# EAGLE design PrimaryLogger (EAGLE 9.5.2)

## Sheet 1 of 2
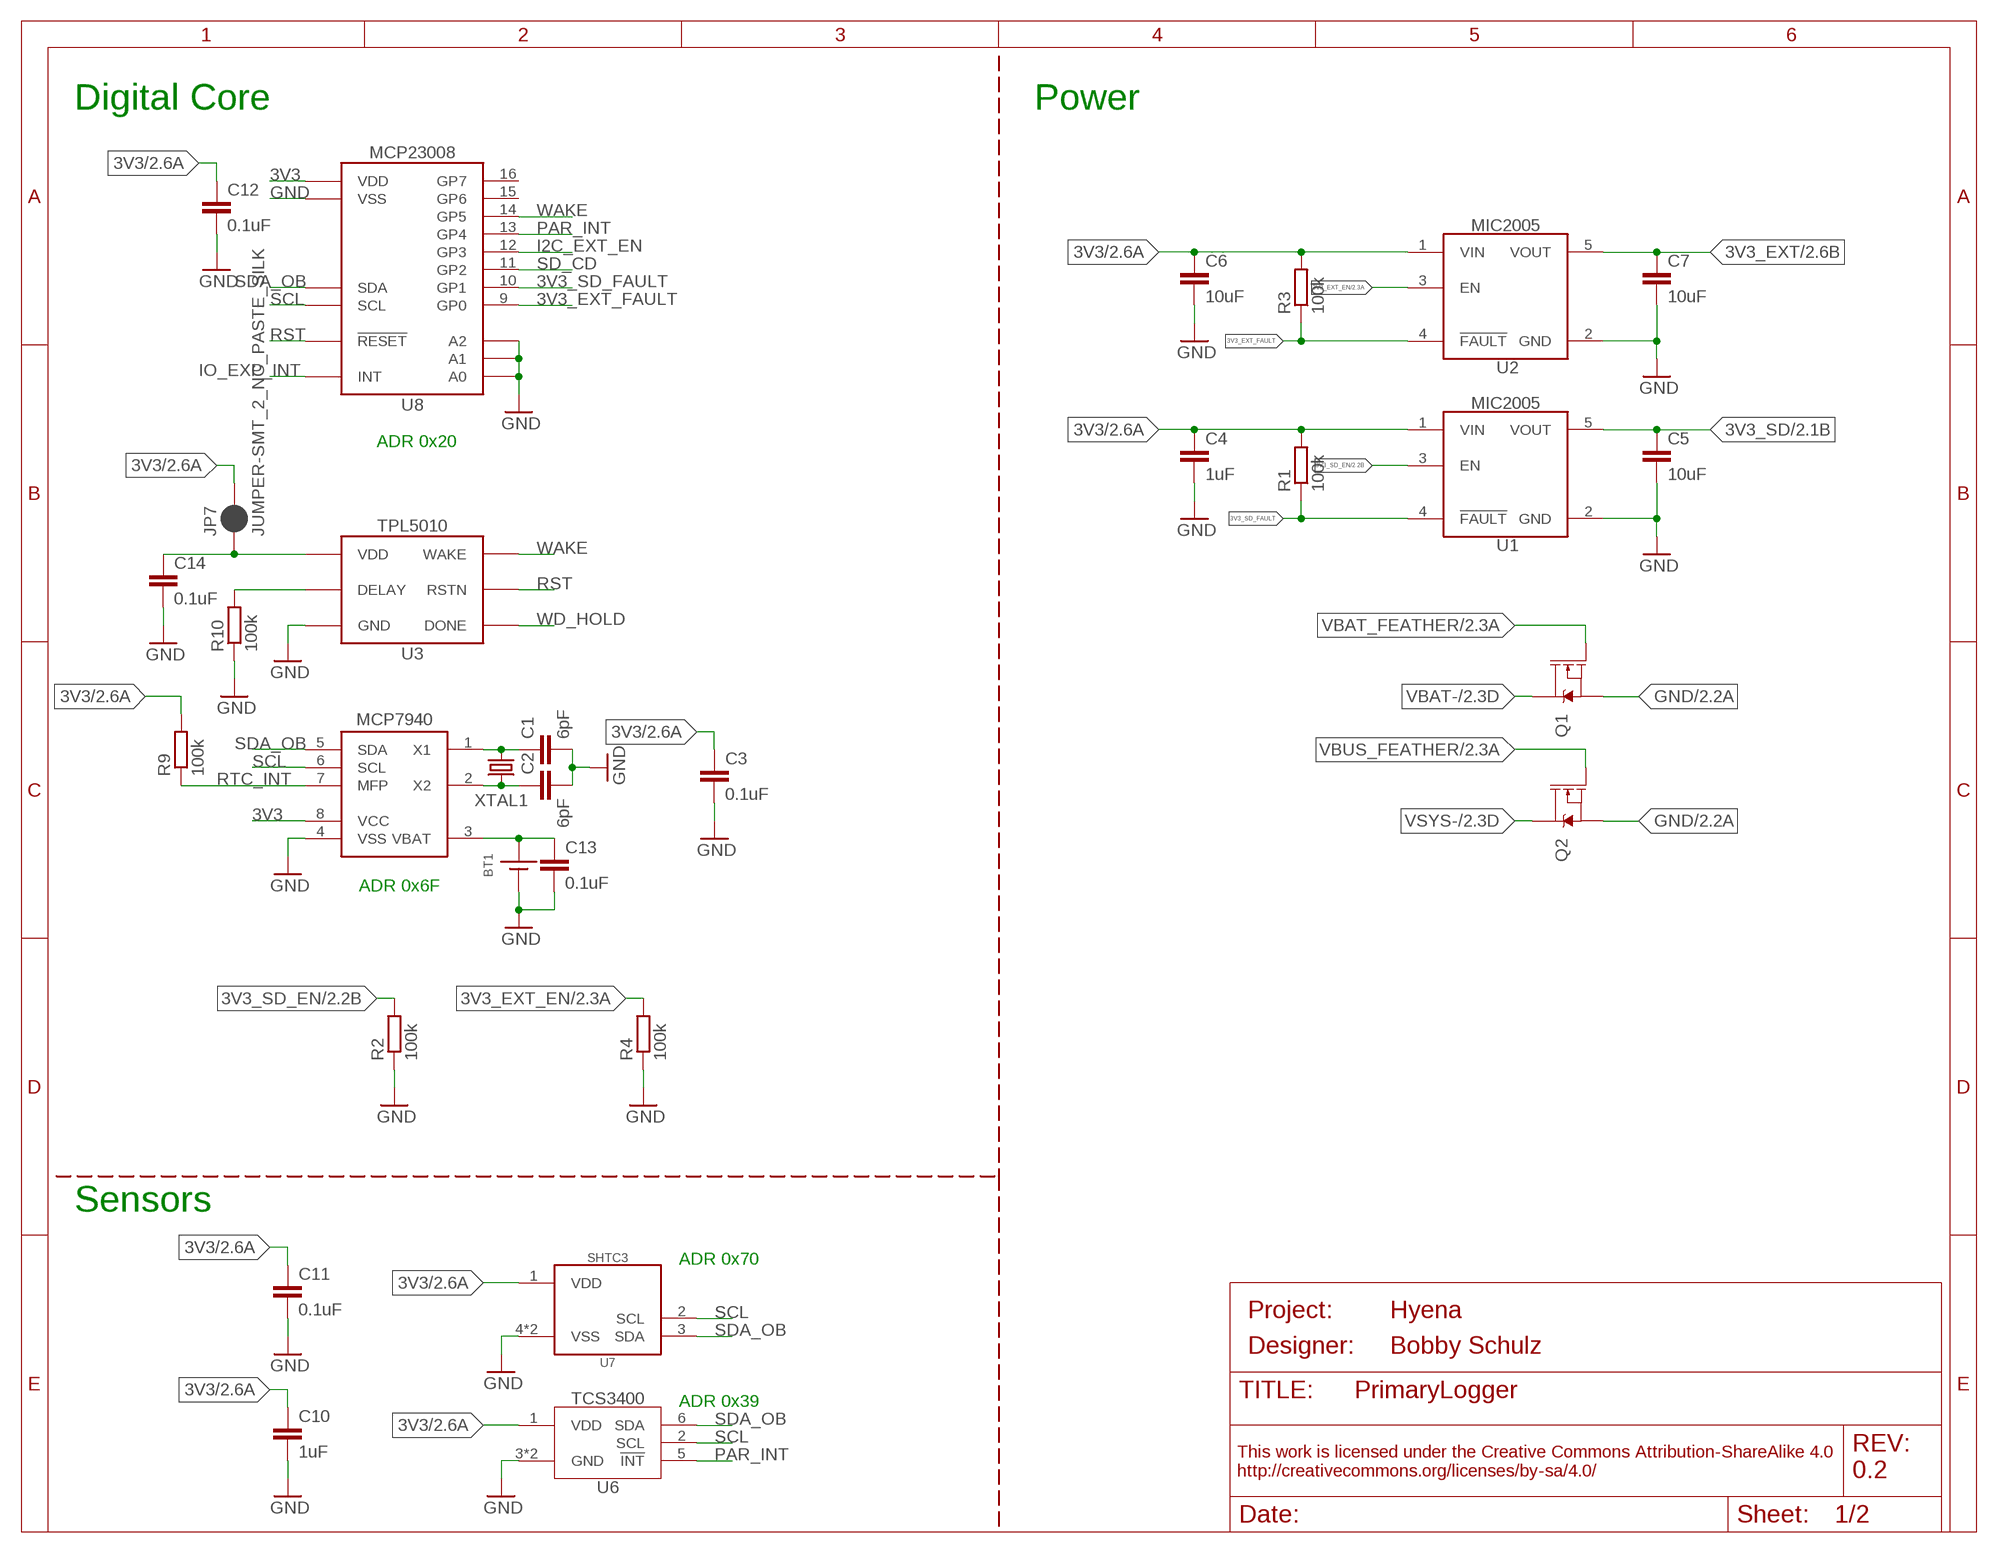
[diagram p0: schematic, sheet 1]
FRAME1 (FRAME_A_L): DESIGNER: Bobby Schulz; PROJECT: Hyena; REV: 0.2

### Parts
BT1  BATTERY_COIN12MM  [LINX_BAT-HLD-012-SMT]
C1  6pF  C-EU6PFC0402  [C0402]
C2  6pF  C-EU6PFC0402  [C0402]
C3  0.1uF  C-EU0.1UFC0603  [C0603]
C4  1uF  C-EU1UFC0603  [C0603]
C5  10uF  C-EU10UFC0805  [C0805]
C6  10uF  C-EU10UFC0805  [C0805]
C7  10uF  C-EU10UFC0805  [C0805]
C10  1uF  C-EU1UFC0603  [C0603]
C11  0.1uF  C-EU0.1UFC0603  [C0603]
C12  0.1uF  C-EU0.1UFC0603  [C0603]
C13  0.1uF  C-EU0.1UFC0603  [C0603]
C14  0.1uF  C-EU0.1UFC0603  [C0603]
JP7  JUMPER-SMT_2_NC_PASTE_SILK  [SMT-JUMPER_2_NC_PASTE_SILK]
Q1  DMG3404  MOSFET-NCH-DMG3404L  [SOT23-3]
Q2  DMG3404  MOSFET-NCH-DMG3404L  [SOT23-3]
R1  100k  R-EU_100KR0603  [R0603]
R2  100k  R-EU_100KR0603  [R0603]
R3  100k  R-EU_100KR0603  [R0603]
R4  100k  R-EU_100KR0603  [R0603]
R9  100k  R-EU_100KR0603  [R0603]
R10  100k  R-EU_100KR0603  [R0603]
U1  MIC2005  [SOT23-5]
U2  MIC2005  [SOT23-5]
U3  TPL5010DDC  [DDC_R-PDSO-G6]
U6  TCS3400  [TCS3400]
U7  SHTC3DFN  [DFN_4_2X2]
U8  MCP23008QFN  [QFN20]
U9  MCP7940SOIC  [SO08]
XTAL1  CRYSTAL3.2X1.5  [CRYSTAL_3.2X1.5_2-SMD]

### Nets
3V3: C3.1 C4.1 C6.1 C10.1 C11.1 C12.1 JP7.2 R1.2 R3.2 R9.2 U1.1(VIN) U2.1(VIN) U6.1(VDD) U7.1(VDD) U8.18(VDD) U9.8(VCC) ; also sheet 2
3V3_EXT: C7.1 U2.5(VOUT) ; also sheet 2
3V3_EXT_EN: R4.2 U2.3(EN) ; also sheet 2
3V3_EXT_FAULT: R3.1 U2.4(!FAULT) U8.9(GP0)
3V3_SD: C5.1 U1.5(VOUT) ; also sheet 2
3V3_SD_EN: R2.2 U1.3(EN) ; also sheet 2
3V3_SD_FAULT: R1.1 U1.4(!FAULT) U8.10(GP1)
GND: BT1.GND(-) C1.2 C2.2 C3.2 C4.2 C5.2 C6.2 C7.2 C10.2 C11.2 C12.2 C13.2 C14.2 Q1.2(S) Q2.2(S) R2.1 R4.1 R10.1 U1.2(GND) U2.2(GND) U3.2(GND) U6.3(GND) U6.4(GND) U7.4(VSS) U7.EP(VSS) U8.1(A2) U8.2(A1) U8.3(A0) U8.17(VSS) U8.EP(VSS) U9.4(VSS) ; also sheet 2
I2C_EXT_EN: U8.12(GP3) ; also sheet 2
IO_EXP_INT: U8.7(INT) ; also sheet 2
N$1: C1.1 U9.1(X1) XTAL1.P$1
N$2: C2.1 U9.2(X2) XTAL1.P$2
N$3: R10.2 U3.3(DELAY)
N$6: C14.1 JP7.1 U3.1(VDD)
PAR_INT: U6.5(!INT) U8.13(GP4) ; also sheet 2
RST: U3.6(RSTN) U8.4(!RESET) ; also sheet 2
RTC_INT: R9.1 U9.7(MFP) ; also sheet 2
SCL: U6.2(SCL) U7.2(SCL) U8.19(SCL) U9.6(SCL) ; also sheet 2
SD_CD: U8.11(GP2) ; also sheet 2
SDA_OB: U6.6(SDA) U7.3(SDA) U8.20(SDA) U9.5(SDA) ; also sheet 2
VBAT: BT1.POWER0(+) BT1.POWER1(+) C13.1 U9.3(VBAT)
VBAT-: Q1.3(D) ; also sheet 2
VBAT_FEATHER: Q1.1(G) ; also sheet 2
VBUS_FEATHER: Q2.1(G) ; also sheet 2
VSYS-: Q2.3(D) ; also sheet 2
WAKE: U3.5(WAKE) U8.14(GP5)
WD_HOLD: U3.4(DONE) ; also sheet 2
Unconnected: U8.15(GP6) U8.16(GP7)

### Notes on the sheet
- Digital Core | Power
- ADR 0x20
- ADR 0x6F
- Sensors
- ADR 0x70
- ADR 0x39

## Sheet 2 of 2
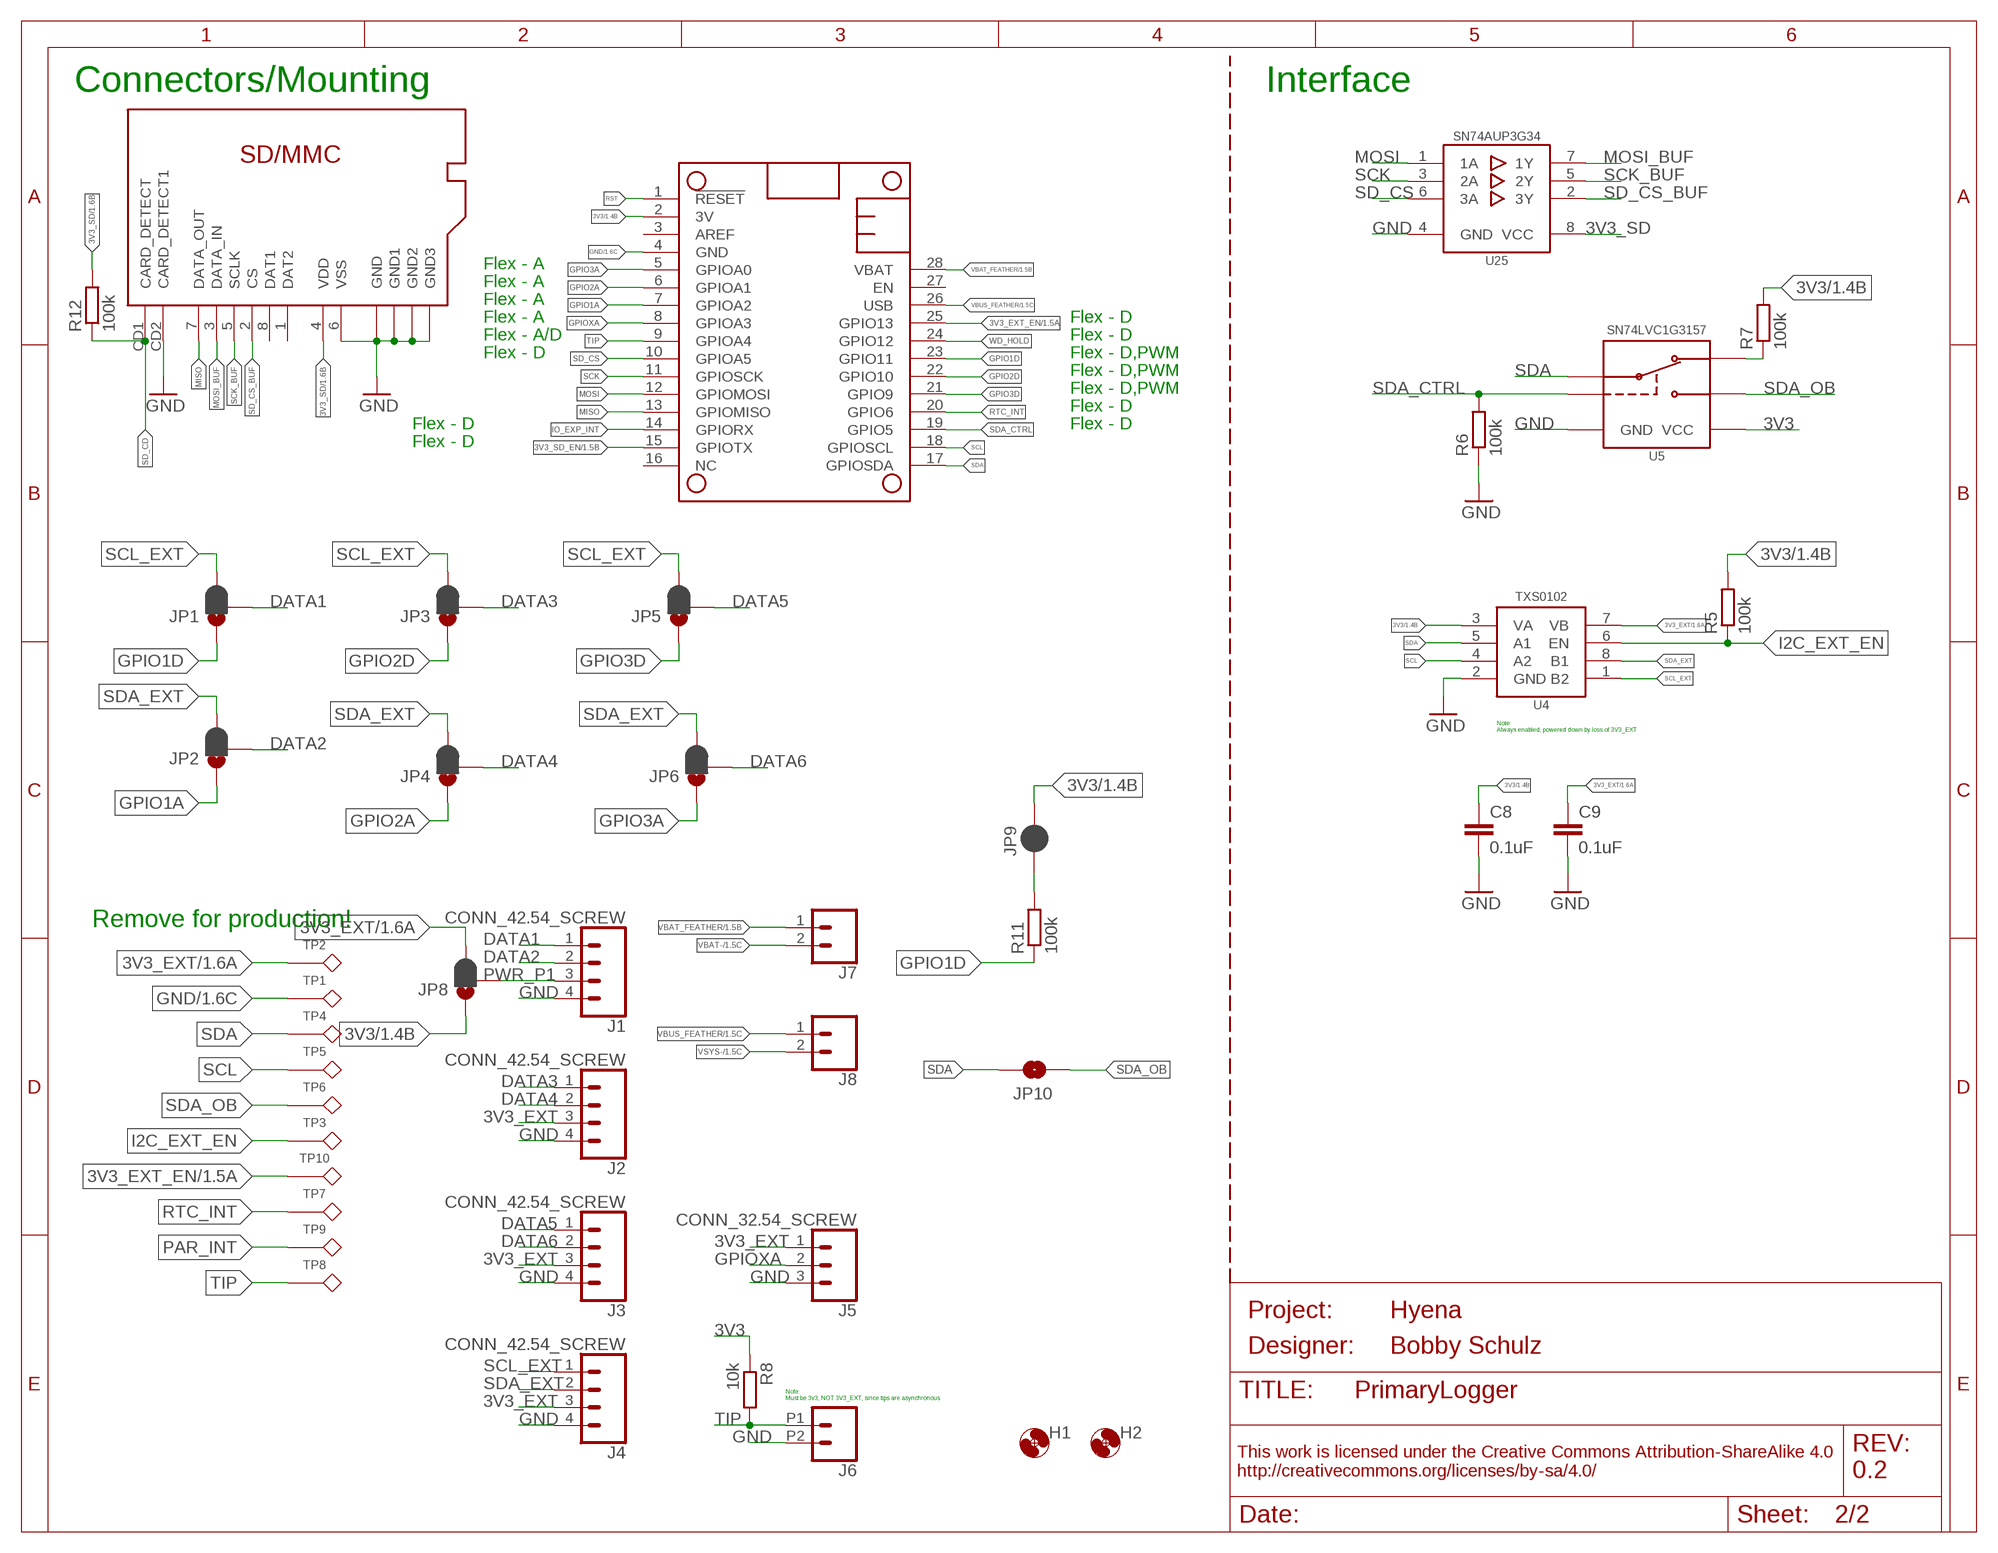
[diagram p1: schematic, sheet 2]
FRAME2 (FRAME_A_L): DESIGNER: Bobby Schulz; PROJECT: Hyena; REV: 0.2

### Parts
C8  0.1uF  C-EU0.1UFC0603  [C0603]
C9  0.1uF  C-EU0.1UFC0603  [C0603]
H1  MOUNTING_HOLE4_NP  [4_40]
H2  MOUNTING_HOLE4_NP  [4_40]
J1  CONN_42.54_SCREW  [1X04_SCREW]
J2  CONN_42.54_SCREW  [1X04_SCREW]
J3  CONN_42.54_SCREW  [1X04_SCREW]
J4  CONN_42.54_SCREW  [1X04_SCREW]
J5  CONN_32.54_SCREW  [1X03_SCREW]
J6  CONN_022.54_SCREW_ROUND  [1X02_2.54_SCREWTERM_ROUND]
J7  CONN_023.5MM_ROUND  [SCREWTERMINAL-3.5MM-2_ROUND]
J8  CONN_023.5MM_ROUND  [SCREWTERMINAL-3.5MM-2_ROUND]
JP1  JUMPER-SMT_3_1-NC_PASTE_SILK  [SMT-JUMPER_3_1-NC_PASTE_SILK]
JP2  JUMPER-SMT_3_1-NC_PASTE_SILK  [SMT-JUMPER_3_1-NC_PASTE_SILK]
JP3  JUMPER-SMT_3_1-NC_PASTE_SILK  [SMT-JUMPER_3_1-NC_PASTE_SILK]
JP4  JUMPER-SMT_3_1-NC_PASTE_SILK  [SMT-JUMPER_3_1-NC_PASTE_SILK]
JP5  JUMPER-SMT_3_1-NC_PASTE_SILK  [SMT-JUMPER_3_1-NC_PASTE_SILK]
JP6  JUMPER-SMT_3_1-NC_PASTE_SILK  [SMT-JUMPER_3_1-NC_PASTE_SILK]
JP8  JUMPER-SMT_3_1-NC_PASTE_SILK  [SMT-JUMPER_3_1-NC_PASTE_SILK]
JP9  JUMPER-SMT_2_NC_PASTE_SILK  [SMT-JUMPER_2_NC_PASTE_SILK]
JP10  JUMPER-SMT_2_NO_SILK  [SMT-JUMPER_2_NO_SILK]
MS1  FEATHERWING_NODIM  [FEATHERWING_DIM]
R5  100k  R-EU_100KR0603  [R0603]
R6  100k  R-EU_100KR0603  [R0603]
R7  100k  R-EU_100KR0603  [R0603]
R8  10k  R-EU_10KR0603  [R0603]
R11  100k  R-EU_100KR0603  [R0603]
R12  100k  R-EU_100KR0603  [R0603]
SD1  MICRO_SD  [CUSTOM-PARTS_SD_MICRO]
TP1  TESTPOINTRCU  [TESTPOINT_0603]
TP2  TESTPOINTRCU  [TESTPOINT_0603]
TP3  TESTPOINTRCU  [TESTPOINT_0603]
TP4  TESTPOINTRCU  [TESTPOINT_0603]
TP5  TESTPOINTRCU  [TESTPOINT_0603]
TP6  TESTPOINTRCU  [TESTPOINT_0603]
TP7  TESTPOINTRCU  [TESTPOINT_0603]
TP8  TESTPOINTRCU  [TESTPOINT_0603]
TP9  TESTPOINTRCU  [TESTPOINT_0603]
TP10  TESTPOINTRCU  [TESTPOINT_0603]
U4  TXS0102DCU  [DCU_(R-PDSO-G8)]
U5  SN74LVC1G3157SC70  [DCK_R-PDSO-G6]
U25  SN74AUP3G34DCU  [DCU_(R-PDSO-G8)]

### Nets
3V3: C8.1 JP8.1 JP9.2 MS1.2(3V) R5.2 R7.2 R8.1 U4.3(VA) U5.5(VCC) ; also sheet 1
3V3_EXT: C9.1 J2.3 J3.3 J4.3 J5.1 JP8.3 TP2.1 U4.7(VB) ; also sheet 1
3V3_EXT_EN: MS1.25(GPIO13) TP10.1 ; also sheet 1
3V3_SD: R12.2 SD1.4(VDD) U25.8(VCC) ; also sheet 1
3V3_SD_EN: MS1.15(GPIOTX) ; also sheet 1
DATA1: J1.1 JP1.2
DATA2: J1.2 JP2.2
DATA3: J2.1 JP3.2
DATA4: J2.2 JP4.2
DATA5: J3.1 JP5.2
DATA6: J3.2 JP6.2
GND: C8.2 C9.2 J1.4 J2.4 J3.4 J4.4 J5.3 J6.P2 MS1.4(GND) R6.1 SD1.6(VSS) SD1.CD2(CARD_DETECT1) SD1.GND@1(GND) SD1.GND@2(GND1) SD1.GND@3(GND2) SD1.GND@5(GND3) TP1.1 U4.2(GND) U5.2(GND) U25.4(GND) ; also sheet 1
GPIO1A: JP2.1 MS1.7(GPIOA2)
GPIO1D: JP1.1 MS1.23(GPIO11) R11.1
GPIO2A: JP4.1 MS1.6(GPIOA1)
GPIO2D: JP3.1 MS1.22(GPIO10)
GPIO3A: JP6.1 MS1.5(GPIOA0)
GPIO3D: JP5.1 MS1.21(GPIO9)
GPIOXA: J5.2 MS1.8(GPIOA3)
I2C_EXT_EN: R5.1 TP3.1 U4.6(EN) ; also sheet 1
IO_EXP_INT: MS1.14(GPIORX) ; also sheet 1
MISO: MS1.13(GPIOMISO) SD1.7(DATA_OUT)
MOSI: MS1.12(GPIOMOSI) U25.1(1A)
MOSI_BUF: SD1.3(DATA_IN) U25.7(1Y)
N$4: R7.1 U5.3(B1)
N$5: JP9.1 R11.2
PAR_INT: TP9.1 ; also sheet 1
PWR_P1: J1.3 JP8.2
RST: MS1.1(!RESET) ; also sheet 1
RTC_INT: MS1.20(GPIO6) TP7.1 ; also sheet 1
SCK: MS1.11(GPIOSCK) U25.3(2A)
SCK_BUF: SD1.5(SCLK) U25.5(2Y)
SCL: MS1.18(GPIOSCL) TP5.1 U4.4(A2) ; also sheet 1
SCL_EXT: J4.1 JP1.3 JP3.3 JP5.3 U4.1(B2)
SD_CD: R12.1 SD1.CD1(CARD_DETECT) ; also sheet 1
SD_CS: MS1.10(GPIOA5) U25.6(3A)
SD_CS_BUF: SD1.2(CS) U25.2(3Y)
SDA: JP10.2 MS1.17(GPIOSDA) TP4.1 U4.5(A1) U5.4(A)
SDA_CTRL: MS1.19(GPIO5) R6.2 U5.6(S)
SDA_EXT: J4.2 JP2.3 JP4.3 JP6.3 U4.8(B1)
SDA_OB: JP10.1 TP6.1 U5.1(B2) ; also sheet 1
TIP: J6.P1 MS1.9(GPIOA4) R8.2 TP8.1
VBAT-: J7.2 ; also sheet 1
VBAT_FEATHER: J7.1 MS1.28(VBAT) ; also sheet 1
VBUS_FEATHER: J8.1 MS1.26(USB) ; also sheet 1
VSYS-: J8.2 ; also sheet 1
WD_HOLD: MS1.24(GPIO12) ; also sheet 1
Unconnected: MS1.3(AREF) MS1.16(NC) MS1.27(EN) SD1.1(DAT2) SD1.8(DAT1)

### Notes on the sheet
- Connectors/Mounting | Interface
- Flex - A
- Flex - A
- Flex - A
- Flex - A | Flex - D
- Flex - A/D | Flex - D
- Flex - D | Flex - D,PWM
- Flex - D,PWM
- Flex - D,PWM
- Flex - D
- Flex - D | Flex - D
- Flex - D
- Note:
  Always enabled, powered down by loss of 3V3_EXT
- Remove for production!
- Note:
  Must be 3v3, NOT 3V3_EXT, since tips are asynchronous

## Library data of the parts
BT1 = bschulz:BATTERY_COIN: Coin Cell Battery Holder; DIGIKEY: BAT-HLD-012-SMT-ND; MF: Linx; MPN: BAT-HLD-012-SMT
C1 C2 = bschulz_passives:C-EU: CAPACITOR, European symbol; DIGIKEY: 490-3104-1-ND; MF: Murata; MPN: GJM1555C1H6R0CB01D
C3 C8 C9 C11-C14 = bschulz_passives:C-EU: CAPACITOR, European symbol; DIGIKEY: 490-6051-1-ND; MF: Murata; MPN: GCM188R71E104KA57D
C4 C10 = bschulz_passives:C-EU: CAPACITOR, European symbol; DIGIKEY: 587-1251-1-ND; MF: Yaiyo Yuden; MPN: EMK107BJ105KA-T
C5-C7 = bschulz_passives:C-EU: CAPACITOR, European symbol; DIGIKEY: 490-6473-6-ND; MF: Murata; MPN: GRM21BR61C106KE15K
H1 H2 = bschulz:MOUNTING_HOLE: Genaric Mechanical Mounting Hole Hole diameter based on max body diameter + 15% Keepout ring is for diameter of socket cap screw (minimum required clearance) TPlace ring is for diameter of pan head screw (recomended clearance) Specifications: Socket Cap <http://fastener-express.com/fastener-technical/SocketscapSS-Alloy.pdf> Button Head Socket Cap <http://fastener-express.com/fastener-technical/Button-Socket-alloy.pdf> Pan Head <http://fastener-express.com/fastener-technical/pan-machine-Screws.pdf>; DIGIKEY: DNP; MF: N/A; MPN: DNP
J1-J4 = bschulz:CONN_4: Genaric 4 terminal header Digikey 2.54_SCREW <https://www.digikey.com/product-detail/en/on-shore-technology-inc/OSTVN04A150/ED10563-ND/1588864>; DIGIKEY: ED10563-ND; MF: On Shore; MPN: OSTVN04A150
J5 = bschulz:CONN_3: Genaric 3 terminal header Digikey 2.54_SCREW <https://www.digikey.com/product-detail/en/on-shore-technology-inc/OSTVN03A150/ED10562-ND/1588863> 3.5_SCREW <https://www.digikey.com/product-detail/en/on-shore-technology-inc/OSTTE030161/ED2636-ND/614585>; DIGIKEY: ED10562-ND; MF: On Shore; MPN: OSTVN03A150
J6 = bschulz:CONN_02: Genaric 2 terminal header SCREW_2.54 <https://www.digikey.com/product-detail/en/on-shore-technology-inc/OSTVN02A150/ED10561-ND/1588862> 39532_RA <https://www.digikey.com/product-detail/en/molex/0395321002/WM7845-ND/1280696>; DIGIKEY: ED10561-ND; MF: OnShore; MPN: OSTVN02A150
J7 J8 = bschulz:CONN_02: Genaric 2 terminal header SCREW_2.54 <https://www.digikey.com/product-detail/en/on-shore-technology-inc/OSTVN02A150/ED10561-ND/1588862> 39532_RA <https://www.digikey.com/product-detail/en/molex/0395321002/WM7845-ND/1280696>; DIGIKEY: ED2635-ND; MF: OnShore; MPN: OSTTE020161
JP1-JP6 JP8 = bschulz:JUMPER-SMT_3_1-NC_PASTE: Normally closed solder jumper (1 of 2 connections) This jumper has an aperture in the stencil to allow solder paste to bridge one of the two connections. One connection is normally closed (NC), while the other is normally open (NO). Wick off the solder to open the connection. Reapply solder to reclose the connection. Apply solder to the other side instead to change the current path.; DIGIKEY: DNP; MF: N/A; MPN: N/A
JP7 JP9 = bschulz:JUMPER-SMT_2_NC_PASTE: Normally closed solder jumper This jumper has an aperture in the stencil to allow solder paste to bridge the split in the wire so it's normally closed (NC). Wick off the solder to open the connection. Reapply solder to reclose the connection.; DIGIKEY: DNP; MF: N/A; MPN: N/A
JP10 = bschulz:JUMPER-SMT_2_NO: Normally open jumper This jumper has two pads in close proximity to each other. Apply solder to close the connection. Round pads are easier to solder for beginners, but are a lot larger. SparkFun Product that uses the round pads: SparkFun EL Sequencer <https://www.sparkfun.com/products/12781>; DIGIKEY: DNP; MF: N/A; MPN: N/A
MS1 = bschulz:FEATHERWING
Q1 Q2 = bschulz:MOSFET-NCH: N-channel MOSFETs Voltage controlled devices that allow control of high current outputs. SparkFun Products: SparkFun OpenScale <https://www.sparkfun.com/products/13261> SparkFun Digital Sandbox <https://www.sparkfun.com/products/12651> SparkFun Monster Moto Shield <https://www.sparkfun.com/products/10182> SparkFun MOSFET Power Controller <https://www.sparkfun.com/products/11214>; DIGIKEY: DMG3404L-7DICT-ND; MF: Diodes Incorporated; MPN: DMG3404L-7
R1-R7 R9-R12 = bschulz_passives:R-EU_: RESISTOR, European symbol Digikey Parts: Yageo, 0402 <https://www.digikey.com/products/en/resistors/chip-resistor-surface-mount/52?k=&pkeyword=&sv=0&s=4356&sf=1&FV=-1%7C13%2C7%7C2%2C1291%7C39157%2C1989%7C0%2C-8%7C52%2C3%7C1131%2C3%7C2503&quantity=&ColumnSort=0&page=1&stock=1&pageSize=25> Yageo, 0603 <https://www.digikey.com/products/en/resistors/chip-resistor-surface-mount/52?k=&pkeyword=&sv=0&pv1291=39245&sf=1&FV=-5%7C4356%2C-5%7C47360%2C-8%7C52%2C-1%7C13%2C7%7C2%2C1989%7C0&quantity=10&ColumnSort=1000011&page=1&stock=1&pageSize=25> Panasonic, 0603 <https://www.digikey.com/products/en/resistors/chip-resistor-surface-mount/52?k=&pkeyword=&pv252=68&sf=0&FV=ffec373d%2C1c0002%2C142c040c%2C1f140000%2Cffe00034%2C80002%2Cc0001&quantity=&ColumnSort=0&page=1&stock=1&pageSize=25> Panasonic, precision, 0603 <https://www.digikey.com/products/en/resistors/chip-resistor-surface-mount/52?FV=ffec4907%2Cfffc000a%2Cc0172%2C142c040c%2C1f140000%2Cffe00034%2C1c0002&quantity=100&ColumnSort=2085&page=1&stock=1&pageSize=25> Panasonic, 0805 <https://www.digikey.com/products/en/resistors/chip-resistor-surface-mount/52?k=&pkeyword=&pv3=1&sf=0&FV=ffec373d%2C1c0002%2C1f140000%2Cffe00034%2C142c040d&quantity=&ColumnSort=0&page=1&stock=1&pageSize=25> Rohm, current sense <https://www.digikey.com/products/en/resistors/chip-resistor-surface-mount/52?k=&pkeyword=&pv3=1&sf=0&FV=ffecb688%2C1f140000%2Cffe00034%2C1c0002&quantity=&ColumnSort=0&page=1&stock=1&pageSize=25> Vishay, pulse proof automotive <https://www.digikey.com/products/en/resistors/chip-resistor-surface-mount/52?k=&pkeyword=&pv7=2&sf=0&FV=ffec5d6b%2Cffe00034%2C1f140000&quantity=&ColumnSort=0&page=1&stock=1&pageSize=25>; DIGIKEY: 311-100KHRCT-ND; MF: Yageo; MPN: RC0603FR-07100KL; VALUE_PART: 100k
R8 = bschulz_passives:R-EU_: RESISTOR, European symbol Digikey Parts: Yageo, 0402 <https://www.digikey.com/products/en/resistors/chip-resistor-surface-mount/52?k=&pkeyword=&sv=0&s=4356&sf=1&FV=-1%7C13%2C7%7C2%2C1291%7C39157%2C1989%7C0%2C-8%7C52%2C3%7C1131%2C3%7C2503&quantity=&ColumnSort=0&page=1&stock=1&pageSize=25> Yageo, 0603 <https://www.digikey.com/products/en/resistors/chip-resistor-surface-mount/52?k=&pkeyword=&sv=0&pv1291=39245&sf=1&FV=-5%7C4356%2C-5%7C47360%2C-8%7C52%2C-1%7C13%2C7%7C2%2C1989%7C0&quantity=10&ColumnSort=1000011&page=1&stock=1&pageSize=25> Panasonic, 0603 <https://www.digikey.com/products/en/resistors/chip-resistor-surface-mount/52?k=&pkeyword=&pv252=68&sf=0&FV=ffec373d%2C1c0002%2C142c040c%2C1f140000%2Cffe00034%2C80002%2Cc0001&quantity=&ColumnSort=0&page=1&stock=1&pageSize=25> Panasonic, precision, 0603 <https://www.digikey.com/products/en/resistors/chip-resistor-surface-mount/52?FV=ffec4907%2Cfffc000a%2Cc0172%2C142c040c%2C1f140000%2Cffe00034%2C1c0002&quantity=100&ColumnSort=2085&page=1&stock=1&pageSize=25> Panasonic, 0805 <https://www.digikey.com/products/en/resistors/chip-resistor-surface-mount/52?k=&pkeyword=&pv3=1&sf=0&FV=ffec373d%2C1c0002%2C1f140000%2Cffe00034%2C142c040d&quantity=&ColumnSort=0&page=1&stock=1&pageSize=25> Rohm, current sense <https://www.digikey.com/products/en/resistors/chip-resistor-surface-mount/52?k=&pkeyword=&pv3=1&sf=0&FV=ffecb688%2C1f140000%2Cffe00034%2C1c0002&quantity=&ColumnSort=0&page=1&stock=1&pageSize=25> Vishay, pulse proof automotive <https://www.digikey.com/products/en/resistors/chip-resistor-surface-mount/52?k=&pkeyword=&pv7=2&sf=0&FV=ffec5d6b%2Cffe00034%2C1f140000&quantity=&ColumnSort=0&page=1&stock=1&pageSize=25>; DIGIKEY: 311-10.0KHRCT-ND; MF: Yageo; MPN: RC0603FR-0710KL; VALUE_PART: 10k
SD1 = bschulz:MICRO_SD: Micro SD Card - Card Detect, Exposed leads for non-reflow soldering Characteristics: Number of Positions: 10 (8 + 2) Insertion/Removal: Push In, Pull Out Switch: Yes Digikey: 114-00841-68-1-ND (Amphenol) <https://www.digikey.com/product-detail/en/amphenol-icc-commercial-products/114-00841-68/114-00841-68-1-ND/2187101> HR1941CT-ND (Hirose Alternative) <https://www.digikey.com/product-detail/en/hirose-electric-co-ltd/DM3D-SF/HR1941CT-ND/1786515>; DIGIKEY: 114-00841-68-1-ND; MF: Amphenol; MPN: 114-00841-68
TP1-TP10 = bschulz:TESTPOINT; DIGIKEY: A106145CT-ND; MF: TE Connectivity; MPN: RCU-0C
U1 U2 = bschulz:MIC2005: MIC2005 - Hight Side Load Switch, with Fixed Current Limit Characteristics: Vin: 2.5v ~ 5.5v IQ: 1μA (OFF), 80μA (ON) RDS(ON): 170mΩ (Vin = 5v) UVLO: 2.25V Output Current: 500/800/1200mA Operating Temperature: -40°C to 85°C Digikey: MIC2005A-1 <https://www.digikey.com/product-detail/en/microchip-technology/MIC2005A-1YM5-TR/576-3462-1-ND/2062462>; DIGIKEY: 576-3462-1-ND; DISP: MIC2005; MF: Microchip; MPN: MIC2005A-1YM5-TR
U3 = bschulz:TPL5010: TPL5010 - Nano-Power System Timer with Watchdog Functionality Characteristics: Vdd: 1.8V ~ 5.5V IQ: 35nA (typ) Period: 100ms ~ 7200 s Operating Temperature: -40°C to 85°C Digikey: 296-38829-1-ND <https://www.digikey.com/product-detail/en/texas-instruments/TPL5010DDCT/296-38829-1-ND/5130149>; DIGIKEY: 296-38829-1-ND; MF: TI; MPN: TPL5010DDCT
U4 = bschulz:TXS0102: TXS0102 - 2 Channel Bidirectional Voltage Level Translator Characteristics: Vcc: 1.65 ~ 3.6V (Port A), 2.3 ~ 5.5V (Port B) IQ: 14.4μA Output Current: 50mA Output Type: Open Drain/Push-Pull Operating Temperature: -40°C to 85°C Digikey: 296-28368-1-ND (DQE) <https://www.digikey.com/product-detail/en/texas-instruments/TXS0102DQER/296-28368-1-ND/2625893> 296-28435-1-ND (DQM) <https://www.digikey.com/product-detail/en/texas-instruments/TXS0102DQMR/296-28435-1-ND/2638910> 296-21931-1-ND (DCU) <https://www.digikey.com/product-detail/en/texas-instruments/TXS0102DCUR/296-21931-1-ND/1629284>; DIGIKEY: 296-21931-1-ND; MF: TI; MPN: TXS0102DCUR
U5 = bschulz:SN74LVC1G3157: SN74LVC1G3157 - SPDT Analog Switch Characteristics: VCC: 1.65~5.5V Operating Temperature: -40°C to 85°C On state resistace: 15 Ω, Max Channel to Channel Matching: 0.1 Ω, Typical Digikey: 296-14909-1-ND (SC70, DCK) <https://www.digikey.com/product-detail/en/texas-instruments/SN74LVC1G3157DCKR/296-14909-1-ND/562526> 296-18015-1-ND (SOT-666, DRL) <https://www.digikey.com/product-detail/en/texas-instruments/SN74LVC1G3157DRLR/296-18015-1-ND/770530>; DIGIKEY: 296-14909-1-ND; DISP: SN74LVC1G3157; MF: TI; MPN: SN74LVC1G3157DCKR
U6 = bschulz:TCS3400: TCS3400 - Ambient Multi-Band Light Sensor with I2C Interface Characteristics: VCC: 2.7~3.6V VIO: Vcc (TCS34001/5), 1.8V (TCS34003/7) Operating Temperature: -40°C to 70°C Digikey: TCS34003FNMCT-ND <https://www.digikey.com/products/en/sensors-transducers/optical-sensors-ambient-light-ir-uv-sensors/536?k=tcs3400&k=&pkeyword=tcs3400&sv=0&pv7=2&sf=0&FV=-8%7C536%2C1989%7C0&quantity=&ColumnSort=0&page=1&stock=1&pageSize=25>; DIGIKEY: TCS34003FNMCT-ND; MF: AMS; MPN: TCS34003FNM
U7 = bschulz:SHTC*: SHTCx - Digital Humidity and Temperature Sensor Characteristics (for SHTC3): Vcc: 1.62V ~ 3.6V Humidity Resolution: 0.01% RH Humidity Accuracy: ±2% RH Temperature Resolution: 0.01°C Temperature Accuracy: 0.2°C Operating Temperature: -40°C to 125°C Digikey: 1649-1100-1-ND (SHTC3) <https://www.digikey.com/product-detail/en/sensirion-ag/SHTC3/1649-1100-1-ND/8628149> 1649-1015-1-ND (SHTC1) <https://www.digikey.com/product-detail/en/sensirion-ag/SHTC1/1649-1015-1-ND/5872297>; DIGIKEY: 1649-1100-1-ND; DISP: SHTC3; MF: Sensirion; MPN: SHTC3
U8 = bschulz:MCP23008: MCP23008 - I2C I/O Expander, 8 bit wtih interrupt and reset Characteristics: Vcc: 1.8V ~ 5.5V IOut: 25 mA IQ: 1μA Operating Temperature: -40°C to 85°C Internal Configurable Pullups Digikey: MCP23008T-E/MLCT-ND (QFN) <https://www.digikey.com/product-detail/en/microchip-technology/MCP23008T-E-ML/MCP23008T-E-MLCT-ND/7916525> MCP23008T-E/SOCT-ND (SOIC) <https://www.digikey.com/product-detail/en/microchip-technology/MCP23008T-E-SO/MCP23008T-E-SOCT-ND/5358243> MCP23008T-E/SSCT-ND (SSOP) <https://www.digikey.com/product-detail/en/microchip-technology/MCP23008T-E-SS/MCP23008T-E-SSCT-ND/5013523>; DIGIKEY: MCP23008T-E/MLCT-ND; MF: Microchip; MPN: MCP23008T-E/ML
U9 = bschulz:MCP7940: MCP7940 - RTC Characteristics: VCC: 1.8~5.5V VBat: 1.3~5.5V Memory: 64B Interface: I2C Operating Temperature: -40°C to 85°C Digikey: MCP7940N-I/SN-ND <https://www.digikey.com/scripts/DkSearch/dksus.dll?Detail&itemSeq=257151033&uq=636590618847128166> Pin Compatible Alternatives <https://www.digikey.com/products/en/integrated-circuits-ics/clock-timing-real-time-clocks/690?FV=401994%2C26802e4%2C45003ef%2C450041e%2C4500072%2C450050c%2C4500565%2C450057c%2C450057e%2C4500010%2C4500011%2C4500017%2C450017d%2C4500180%2C450004f%2C1f140000%2Cffe002b2%2C16980015%2C1698001a%2C1698001d%2C16980026%2C16980027%2C16980029%2C16980036%2C16980009&quantity=10&ColumnSort=1000011&page=2&stock=1&nstock=1&pageSize=25> Note: These are recomendations at the time, always verify pin compatability using combination of Mrk1 EyeBall and quality datasheet; DIGIKEY: MCP7940N-I/SN-ND; MF: Microchip; MPN: MCP7940N-I/SN
U25 = bschulz:SN74AUP3G34: SN74AUP3G34 - Logic Buffer Characteristics: VCC: 0.8~3.6V Operating Temperature: -40°C to 85°C Number of Gates: 3 /li> Inverting: No Digikey: 296-27503-1-ND (UQFN, RSE) <https://www.digikey.com/scripts/DkSearch/dksus.dll?Detail&itemSeq=257211059&uq=636588853324239862> 296-36973-1-ND (XFDFN, DQE) <https://www.digikey.com/product-detail/en/texas-instruments/SN74AUP3G34DQER/296-36973-1-ND/4428921> 296-25595-1-ND (VFSOP, DCU) <https://www.digikey.com/product-detail/en/texas-instruments/SN74AUP3G34DCUR/296-25595-1-ND/2202056>; DIGIKEY: 296-25595-1-ND; MF: TI; MPN: SN74AUP3G34DCUR
XTAL1 = bschulz:CRYSTAL: Crystal Oscilator 2 Pin quartz crystal oscilators Variants 3.2x1.5mm (Only available in 32.768kHz) <https://www.digikey.com/products/en/crystals-oscillators-resonators/crystals/171?FV=b839bf%2Cb83a33%2C8640001%2C864000f%2C8640003%2C1f140000%2Cmu32.768kHz%7C2150%2Cffe000ab&quantity=10&ColumnSort=1000011&page=1&stock=1&k=crystal&pageSize=25&pkeyword=crystal> 5 x 3.2mm (8MHz ~ 50MHz) <https://www.digikey.com/products/en/crystals-oscillators-resonators/crystals/171?FV=402f3e%2Cb8434d%2C1f140000%2Cffe000ab&quantity=10&ColumnSort=1000011&page=1&stock=1&pageSize=25>; DIGIKEY: 535-11937-1-ND; MF: ABS07-120-32.768KHZ-T; MPN: Abracon

## Board
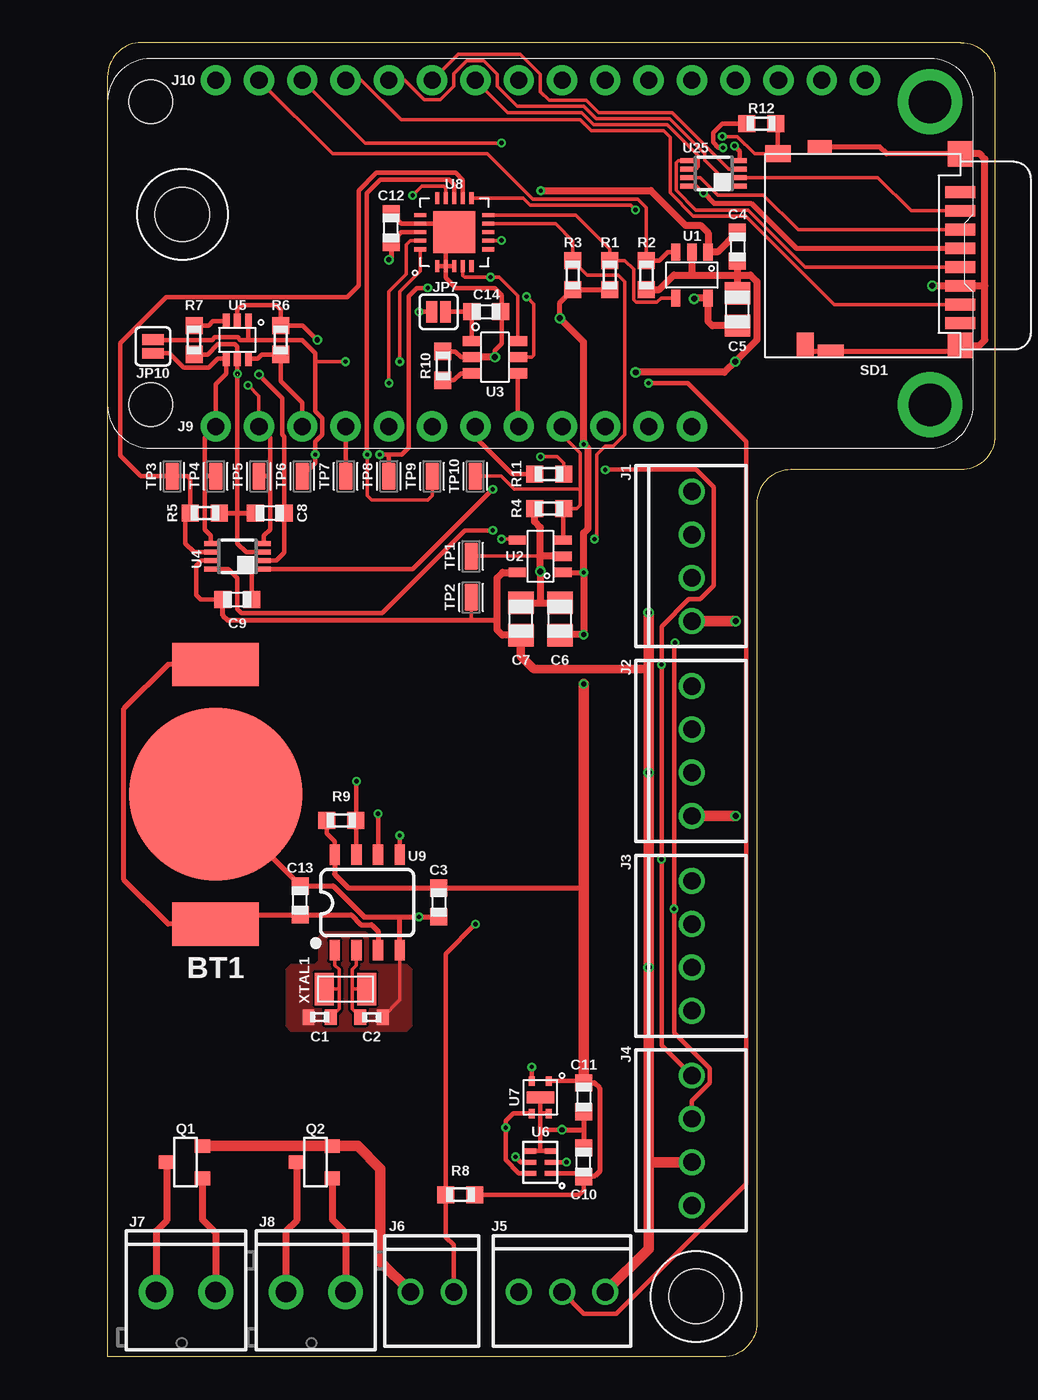
[diagram p2: board, top side]
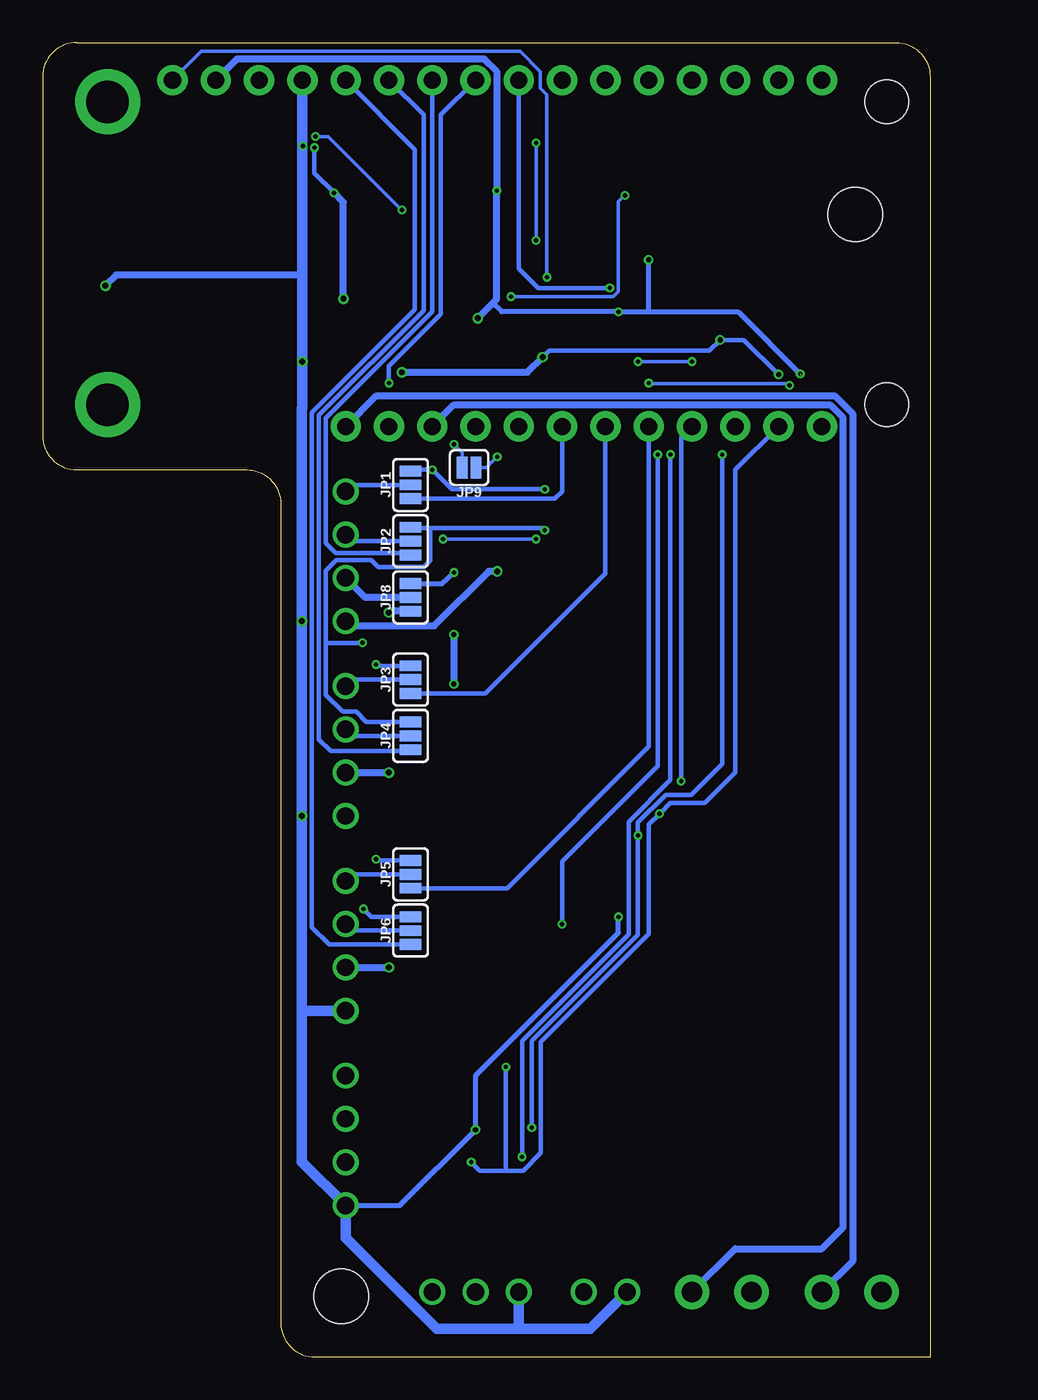
[diagram p3: board, bottom side, seen from below]

Size 52.07 x 77.14 mm. Coordinates in mm from the lower left corner, seen from the top.
Outline: 38.1,50.07 38.1,2 arc-90 36.1,0 0,0 0,75.14 arc-90 2,77.14 50.07,77.14 arc-90 52.07,75.14 52.07,54.07 arc-90 50.07,52.07 40.1,52.07 arc90 38.1,50.07
Copper layers (1*16): Top 0.035559375mm / dielectric 1.6mm / Bottom 0.035559375mm
Design rules "oshpark-2layer": minimum track width 6mil, minimum drill 10mil, track to track 6mil, track to pad 6mil, pad to pad 6mil, via to via 6mil, smd to smd 6mil, copper to edge 15mil, drill to drill 6mil, minimum pad ring 5mil, minimum via ring 5mil, stop-mask expansion 2.5mil, vias tented up to drill 0mil, thermal gap 10mil

### Footprints (pad centres in the part's own frame; a part is rotated, then mirrored left to right if it is on the bottom)
LINX_BAT-HLD-012-SMT = smd 10.16 x 10.16: GND 0,0 | smd 2.54 x 5.08: POWER0 -7.62,0; POWER1 7.62,0
C0402 = smd 0.7 x 0.9: 1 -0.65,0; 2 0.65,0
C0603 = smd 1 x 1: 1 -0.85,0; 2 0.85,0
C0805 = smd 1.3 x 1.5: 1 -0.95,0; 2 0.95,0
4_40 = hole 3.175: 0,0
1X04_SCREW = drill 1.016: 1 -3.81,0; 2 -1.27,0; 3 1.27,0; 4 3.81,0
1X03_SCREW = drill 1.016: 1 -2.54,0; 2 0,0; 3 2.54,0
1X02_2.54_SCREWTERM_ROUND = drill 1.016: P1 1.27,0; P2 -1.27,0
SCREWTERMINAL-3.5MM-2_ROUND = drill 1.2 pad 2.032: 1 0,0; 2 3.5,0
SMT-JUMPER_3_1-NC_PASTE_SILK = smd 0.635 x 1.27: 1 -0.813,0; 2 0,0; 3 0.813,0
SMT-JUMPER_2_NC_PASTE_SILK = smd 0.635 x 1.27: 1 -0.406,0; 2 0.406,0
SMT-JUMPER_2_NO_SILK = smd 0.635 x 1.27: 1 -0.406,0; 2 0.406,0
FEATHERWING_DIM = drill 1 pad 1.778: 1 6.35,1.27; 2 8.89,1.27; 3 11.43,1.27; 4 13.97,1.27; 5 16.51,1.27; 6 19.05,1.27; 7 21.59,1.27; 8 24.13,1.27; 9 26.67,1.27; 10 29.21,1.27; 11 31.75,1.27; 12 34.29,1.27; 13 36.83,1.27; 14 39.37,1.27; 15 41.91,1.27; 16 44.45,1.27; 17 44.45,21.59; 18 41.91,21.59; 19 39.37,21.59; 20 36.83,21.59; 21 34.29,21.59; 22 31.75,21.59; 23 29.21,21.59; 24 26.67,21.59; 25 24.13,21.59; 26 21.59,21.59; 27 19.05,21.59; 28 16.51,21.59 | drill 2.5 pad 3.81: P$1 2.54,20.32; P$2 2.54,2.54 | hole 2.54: 48.26,20.32; 48.26,2.54
SOT23-3 = smd 0.8 x 0.9: 1 -0.95,-1; 2 0.95,-1; 3 0,1.1
R0603 = smd 1 x 1: 1 -0.85,0; 2 0.85,0
CUSTOM-PARTS_SD_MICRO = smd 0.7 x 1.75: 1 -2.25,0; 2 -3.35,0; 3 -4.45,0; 4 -5.55,0; 5 -6.65,0; 6 -7.75,0; 7 -8.85,0; 8 -9.95,0 | smd 1 x 1.5: CD1 0,10.7 | smd 1.5 x 1: CD2 -11.25,9.1 | smd 1.5 x 1.5: GND@1 0,0; GND@2 -11.25,0 | smd 0.8 x 1.5: GND@3 -11.6,7.6 | smd 0.8 x 1.4: GND@5 0.4,8.25
TESTPOINT_0603 = smd 1.6 x 0.8: 1 0,0
SOT23-5 = smd 0.55 x 1: 1 -0.95,-1.35; 2 0,-1.35; 3 0.95,-1.35; 4 0.95,1.35; 5 -0.95,1.35
DDC_R-PDSO-G6 = smd 0.6 x 1.1: 1 -0.95,-1.35; 2 0,-1.35; 3 0.95,-1.35; 4 0.95,1.35; 5 0,1.35; 6 -0.95,1.35
DCU_(R-PDSO-G8) = smd 0.3 x 0.8: 1 -0.75,-1.55; 2 -0.25,-1.55; 3 0.25,-1.55; 4 0.75,-1.55; 5 0.75,1.55; 6 0.25,1.55; 7 -0.25,1.55; 8 -0.75,1.55
DCK_R-PDSO-G6 = smd 0.4 x 0.9: 1 -0.65,-1.1; 2 0,-1.1; 3 0.65,-1.1; 4 0.65,1.1; 5 0,1.1; 6 -0.65,1.1
TCS3400 = smd 0.75 x 0.3: 1 -0.625,0.65; 2 -0.625,0; 3 -0.625,-0.65; 4 0.625,-0.65; 5 0.625,0; 6 0.625,0.65
DFN_4_2X2 = smd 0.55 x 0.35: 1 -0.95,0.5; 2 -0.95,-0.5; 3 0.95,-0.5; 4 0.95,0.5 | smd 0.7 x 1.6: EP 0,0
QFN20 = smd 0.7 x 0.25: 1 -2.032,0.968; 2 -2.032,0.468; 3 -2.032,-0.032; 4 -2.032,-0.532; 5 -2.032,-1.032; 11 1.968,-1.032; 12 1.968,-0.532; 13 1.968,-0.032; 14 1.968,0.468; 15 1.968,0.968 | smd 0.25 x 0.7: 6 -1.032,-2.032; 7 -0.532,-2.032; 8 -0.032,-2.032; 9 0.468,-2.032; 10 0.968,-2.032; 16 0.968,1.968; 17 0.468,1.968; 18 -0.032,1.968; 19 -0.532,1.968; 20 -1.032,1.968 | smd 2.45 x 2.45: EP -0.032,-0.032
SO08 = smd 0.6 x 1.2: 1 -1.905,-2.8; 2 -0.635,-2.8; 3 0.635,-2.8; 4 1.905,-2.8; 5 1.905,2.8; 6 0.635,2.8; 7 -0.635,2.8; 8 -1.905,2.8
CRYSTAL_3.2X1.5_2-SMD = smd 1.1 x 1.9: P$1 -1.25,0; P$2 1.25,0

### Placement (x,y rotation side)
BT1  6.35,33.02 90 top
C1  12.45,19.94 180 top
C2  15.49,19.94 0 top
C3  19.43,26.67 270 top
C4  36.96,65.15 270 top
C5  36.96,61.47 90 top
C6  26.54,43.31 90 top
C7  24.26,43.31 90 top
C8  9.53,49.53 0 top
C9  7.62,44.45 0 top
C10  27.94,11.43 90 top
C11  27.94,15.24 270 top
C12  16.64,66.26 90 top
C13  11.3,26.8 90 top
C14  22.23,61.34 0 top
H1  4.39,67.06 0 top
H2  34.54,3.56 0 top
J1  34.29,46.99 270 top
J2  34.29,35.56 270 top
J3  34.29,24.13 270 top
J4  34.29,12.7 270 top
J5  26.67,3.81 180 top
J6  19.05,3.81 0 top
J7  6.35,3.81 180 top
J8  13.97,3.81 180 top
JP1  30.48,51.18 90 bottom
JP2  30.48,47.88 90 bottom
JP3  30.48,39.75 90 bottom
JP4  30.48,36.45 90 bottom
JP5  30.48,28.32 90 bottom
JP6  30.48,25.02 90 bottom
JP7  19.43,61.34 180 top
JP8  30.48,44.58 270 bottom
JP9  27.05,52.2 180 bottom
JP10  2.67,59.31 270 top
MS1  50.8,76.2 180 top
Q1  4.57,11.43 90 top
Q2  12.19,11.43 90 top
R1  29.46,63.5 270 top
R2  31.62,63.5 90 top
R3  27.3,63.5 270 top
R4  25.91,49.78 0 top
R5  5.71,49.53 0 top
R6  10.16,59.69 270 top
R7  5.08,59.69 270 top
R8  20.7,9.53 180 top
R9  13.72,31.5 180 top
R10  19.68,58.17 270 top
R11  25.91,51.82 0 top
R12  38.35,72.39 180 top
SD1  50.04,70.61 90 top
TP1  21.34,46.99 90 top
TP2  21.34,44.58 90 top
TP3  3.81,51.69 90 top
TP4  6.35,51.69 90 top
TP5  8.89,51.69 90 top
TP6  11.43,51.69 90 top
TP7  13.97,51.69 90 top
TP8  16.51,51.69 90 top
TP9  19.05,51.69 90 top
TP10  21.59,51.69 90 top
U1  34.29,63.5 180 top
U2  25.4,46.99 90 top
U3  22.73,58.67 270 top
U4  7.62,46.99 90 top
U5  7.62,59.69 180 top
U6  25.4,11.43 180 top
U7  25.4,15.24 270 top
U8  20.32,66.04 90 top
U9  15.24,26.67 0 top
U25  35.56,69.47 90 top
XTAL1  13.97,21.59 0 top

### Tracks (layer width: path | path; a pad name or v marks a point on that pad's centre or on a via)
3V3  (via drill 0.25, 0.3, 0.35)  (1 unrouted)
  Top 0.254: R7.2 5.88,58.84 6.48,59.44 7.47,59.44 7.62,59.28 U5.5 v7.62,57.69 | U7.1 27.84,16.19 C11.1 | U6.1 27.79,10.78 27.94,10.63 27.94,9.78 27.69,9.53 R8.1 | U4.3 8.13,47.24 7.62,47.75 7.62,49.53 7.62,57.62 | U8.18 17.24,66.01 C12.1 | JP7.2 v18.29,61.34 | R9.2 12.87,30.73 13.34,30.27 13.34,29.34
  Top 0.305: U9.8 13.34,29.34 13.34,28.32 14.14,27.52 C3.1 27.9,27.52 27.94,27.56 | C11.1 28.56,16.09 28.87,15.78 28.87,10.89 28.61,10.63 27.94,10.63 | U2.1 v27.94,46.04 | R5.2 7.62,49.53 C8.1 | C12.1 16.64,64.52 v16.51,64.39 | R1.2 R3.2 26.54,61.89 v26.54,60.96
  Top 0.406: C4.1 35.81,64.85 U1.1 35.24,65.98 34.8,66.42 33.91,66.42 31.88,68.45 v25.43,68.45 | v26.54,60.96 27.94,59.56 v27.94,53.57 28.19,53.31 28.19,48.61 27.94,48.36 v27.94,46.04 v27.94,42.39 26.58,42.39 C6.1
  Top 0.61: v27.94,39.49 27.94,27.56 C11.1 27.94,16.04 | 27.94,10.63 C10.1
  Bottom 0.2: JP9.2 27.46,53.08 v27.94,53.57
  Bottom 0.305: 25.65,61.85 25.15,61.34 v18.29,61.34 16.51,61.34 | v7.62,57.69 11.27,61.34 16.51,61.34 | 16.51,61.34 v16.51,64.39 | JP8.1 28.65,45.39 v27.94,46.04
  Bottom 0.406: v27.94,42.39 v27.94,39.49 | v26.54,60.96 25.65,61.85 25.43,62.08 v25.43,68.45 25.43,75.45 26.15,76.17 40.66,76.17 MS1.2
3V3_EXT  (via drill 0.35)
  Top 0.2: TP2.1 21.34,43.24
  Top 0.254: C9.1 5.46,44.45 5.21,44.7 5.21,46.45 5.5,46.74 U4.7
  Top 0.305: C9.1 6.77,43.52 7.05,43.24 21.34,43.24 22.8,43.24 22.86,43.18
  Top 0.406: C7.1 23.18,42.36 22.86,42.67 22.86,43.18 22.86,45.72 23.18,46.04 U2.5
  Top 0.508: C7.1 24.26,41.15 25.02,40.39 31.75,40.39
  Top 0.61: J5.1 31.75,6.35 31.75,11.43 | v31.75,43.69 31.75,40.39 v31.75,34.29 v31.75,22.86 31.75,11.43 | J4.3 31.75,11.43
  Bottom 0.406: J2.3 v31.75,34.29 | J3.3 v31.75,22.86 | JP8.3 31.67,43.76 v31.75,43.69
3V3_EXT_EN
  Top 0.2: MS1.25 26.67,54.1 27.74,53.03 27.74,50.93 | R4.2 27.52,49.78 27.74,50 27.74,50.93 | TP10.1 23.11,51.69 23.88,50.93 27.74,50.93
  Top 0.254: 26.67,48.02 U2.3 R4.2 26.67,49.87
3V3_EXT_FAULT  (via drill 0.25)
  Top 0.2: U8.9 26.29,66.51 27.3,65.49 R3.1 28.16,63.5 29.97,63.5 30.35,63.12 30.35,54.14 29.68,53.47 29.21,53.47 28.7,52.96 28.7,48.13 v28.57,48.01 | U2.4 23.98,48.01 v23.11,48.01
  Bottom 0.2: v28.57,48.01 v23.11,48.01
3V3_SD  (via drill 0.25, 0.35)
  Top 0.2: U25.8 34.58,68.72 v34.97,68.32
  Top 0.254: v36.12,70.97 35.85,70.97 35.53,71.28 35.53,71.85 36.08,72.39 R12.2
  Top 0.305: v34.97,68.32 35.58,67.72 37.77,67.72 40.42,65.06 SD1.4
  Top 0.406: v34.42,62.1 34.46,62.15 U1.5 35.24,60.77 35.49,60.52 C5.1
  Bottom 0.254: v34.97,68.32 36.12,69.47 v36.12,70.97
  Bottom 0.406: v34.42,62.1 34.42,67.77 v34.97,68.32
3V3_SD_EN
  Top 0.2: R2.2 31.62,67.44 31.11,67.95 24.96,67.95 22.3,70.61 13.21,70.61 MS1.15
  Top 0.254: R2.2 32.38,64.35 32.88,64.85 U1.3
3V3_SD_FAULT
  Top 0.2: U8.10 27.48,67.01 29.46,65.02 R1.1 30.35,64.35 30.87,63.83 30.87,62.05 31.02,61.9 32.23,61.9 32.48,62.15 U1.4
DATA1
  Bottom 0.254: JP1.2 33.91,51.18 J1.1
DATA2
  Bottom 0.254: JP2.2 33.91,47.88 J1.2
DATA3
  Bottom 0.254: JP3.2 33.91,39.75 J2.1
DATA4
  Bottom 0.254: JP4.2 33.91,36.45 J2.2
DATA5
  Bottom 0.254: JP5.2 33.91,28.32 J3.1
DATA6
  Bottom 0.254: JP6.2 33.91,25.02 J3.2
GND  (via drill 0.25, 0.3, 0.35)
  Top 0.2: U9.4 17.14,20.94 C2.2 | 25.4,46.99 TP1.1
  Top 0.254: U6.4 25.4,12.08 | 25.4,12.08 U6.3 | U8.1 U8.2 | U8.2 U8.3 | R10.1 20.41,59.02 20.75,58.67 U3.2 | 20.32,66.04 19.85,66.51 U8.17 17.24,66.51 C12.2 | 20.32,66.04 U8.EP | U8.2 19.85,65.57 20.32,66.04 | C9.2 8.47,46.57 8.64,46.74 U4.2 9.91,46.74 10.38,47.2 C8.2 10.38,54.01 10.26,54.13 10.26,56.29 v8.89,57.66 | v22.73,58.67 22.73,59.06 23.14,59.47 23.14,61.28 C14.2 23.14,61.41 23.14,62.32 22.73,62.74 20.45,62.74 19.85,63.33 U8.2 | v12.32,59.69 11.47,60.54 R6.1 10.16,61.47 9.91,61.72 7.87,61.72 7.62,61.47 U5.2 | U25.4 37.11,70.76 v36.79,71.08 | U7.EP 25.4,14.29 | 25.4,14.29 25.4,13.34 | 25.4,13.34 25.4,12.08 | U7.4 25.4,14.29 | v26.67,13.34 25.4,13.34
  Top 0.305: 17.14,25.82 15.06,25.82 13.23,27.65 C13.2 11.3,27.69 6.35,32.64 BT1.GND | 17.14,25.82 v18.29,25.82 C3.2 | U9.4 17.14,25.82 | C11.2 27.94,13.34 | 27.94,13.34 C10.2 | v26.67,13.34 27.94,13.34 | SD1.GND@1 45.72,70.61 45.32,71.01 SD1.GND@5 | SD1.GND@2 49.69,59.01 SD1.GND@3 41.29,59.01 SD1.CD2
  Top 0.406: C4.2 36.96,63.5 | 36.96,63.5 C5.2 | R2.1 32.38,62.65 33.23,63.5 34.29,63.5 | 34.29,63.5 36.96,63.5 | U1.2 34.29,63.5 | v30.99,57.78 36.2,57.78 v36.83,58.42 38.1,59.69 38.1,63.12 37.72,63.5 36.96,63.5 | v22.73,58.67 U3.2 | SD1.GND@2 51.16,59.36 51.49,59.69 51.49,62.87 | 51.49,62.87 51.49,70.31 51.18,70.61 SD1.GND@1 | 51.49,62.87 51.48,62.86 SD1.6 v48.39,62.87 | 41.13,59.36 SD1.CD2 | R4.1 25.06,49.02 25.4,48.68 25.4,47.12 | 25.4,47.12 25.4,46.99 v25.4,46.1 25.4,44.26 | 25.4,47.12 25.53,46.99 U2.2 | C7.2 25.4,44.26 | 25.4,44.26 C6.2
  Top 0.61: J6.P2 16,5.59 16,11.05 14.67,12.38 Q2.2 Q1.2 | J1.4 v36.85,43.18 | J2.4 v36.85,31.75
  Bottom 0.254: v8.89,57.66 10.92,59.69 v12.32,59.69 12.95,59.05 22.35,59.05 v22.73,58.67 | v36.79,71.08 36.83,71.12
  Bottom 0.305: J4.4 31.11,8.89 v26.67,13.34 26.67,16.51 18.29,24.89 v18.29,25.82
  Bottom 0.406: J1.4 34.04,42.93 29.08,42.93 25.91,46.1 v25.4,46.1 | v30.99,57.78 23.62,57.78 v22.73,58.67 | 36.83,63.5 47.75,63.5 v48.39,62.87
  Bottom 0.61: MS1.4 36.83,71.12 36.83,63.5 v36.83,58.42 36.83,55.7 36.85,55.67 v36.85,43.18 v36.85,31.75 36.85,20.32 | 36.85,20.32 36.85,11.46 J4.4 34.29,6.99 28.96,1.65 24.13,1.65 | J3.4 36.85,20.32 | 24.13,1.65 19.94,1.65 J6.P2 | 24.13,1.65 J5.3
  pour Top (no thermals): 10.79,22.99 12.2,22.99 12.45,23.23 12.45,24.64 12.7,24.89 15.11,24.89 15.24,24.77 15.24,23.11 15.36,22.99 17.53,22.99 17.78,22.73 17.78,19.43 17.53,19.18 10.79,19.18 10.54,19.43 10.54,22.73
GPIO1A
  Bottom 0.254: JP2.1 30.61,47.19 34.87,47.19 35.46,47.78 35.46,55.09 29.21,61.34 MS1.7
GPIO1D
  Top 0.254: R11.1 23.75,51.82 21.59,53.98 MS1.23
  Bottom 0.254: MS1.23 21.59,50.8 22.02,50.37 JP1.1
GPIO2A
  Bottom 0.254: MS1.6 29.72,72.9 29.72,61.41 35.87,55.26 35.87,36.25 35.18,35.56 30.56,35.56 JP4.1
GPIO2D
  Bottom 0.254: MS1.22 19.05,45.97 26.09,38.94 JP3.1
GPIO3A
  Bottom 0.254: MS1.5 30.23,70.87 30.23,61.48 36.27,55.43 36.27,25.22 35.26,24.21 JP6.1
GPIO3D
  Bottom 0.254: MS1.21 16.51,35.81 24.82,27.51 JP5.1
GPIOXA  (via drill 0.25)
  Top 0.254: J5.2 27.94,2.54 29.84,2.54 37.47,10.16 37.47,53.72 34.04,57.15 v31.75,57.15
  Bottom 0.254: v31.75,57.15 31.75,58.17 28.7,61.21 28.7,72.9 MS1.8
I2C_EXT_EN
  Top 0.254: U4.6 5.08,47.24 4.57,47.75 4.57,49.53 R5.1 4.87,51.52 4.7,51.69 TP3.1 1.95,51.69 0.74,52.89 0.74,59.51 3.45,62.21 14.07,62.21 14.73,62.87 14.73,68.45 15.77,69.49 20.42,69.49 20.85,69.06 U8.12
IO_EXP_INT  (via drill 0.25)
  Top 0.2: MS1.14 15.11,71.25 v23.11,71.25 | v23.11,65.53 23.09,65.51 U8.7
  Bottom 0.2: v23.11,71.25 23.11,66.42 v23.11,65.53
MISO
  Top 0.2: SD1.7 42.65,61.76 37.46,66.96 34.37,66.96 33.01,68.32 33.01,71.6 32.64,71.97 28.38,71.97 27.75,72.6 17.22,72.6 14.9,74.93 MS1.13
MOSI
  Top 0.2: U25.1 36.56,68.72 35.05,70.23 35.05,70.62 33,72.67 28.67,72.67 27.94,73.41 24.04,73.41 22.86,74.59 22.86,75.28 22.06,76.07 21.08,76.07 20.32,75.31 20.32,74.58 19.52,73.79 18.58,73.79 17.44,74.93 MS1.12
MOSI_BUF
  Top 0.2: SD1.3 40.52,66.16 38.48,68.2 35.81,68.2 34.79,69.22 U25.7
N$1
  Top 0.2: U9.1 13.34,22.99 13.59,22.73 13.59,21.59 | 13.59,21.59 13.59,20.43 C1.1 | XTAL1.P$1 13.59,21.59
N$2
  Top 0.2: U9.2 14.61,22.99 14.35,22.73 14.35,21.59 | 14.35,21.59 14.35,20.43 C2.1 | XTAL1.P$2 14.35,21.59
N$3
  Top 0.254: U3.3 20.73,57.72 20.32,57.32 R10.2
N$4
  Top 0.254: 5.25,60.37 R7.1 5.93,60.54 6.18,60.79 U5.3
N$5  (via drill 0.25)
  Top 0.2: R11.2 26.76,52.45 26.38,52.83 v25.4,52.83
  Bottom 0.2: v25.4,52.83 26.04,52.2 JP9.1
N$6
  Top 0.254: U3.1 21.38,59.63 C14.1 JP7.1
PAR_INT  (via drill 0.25)
  Top 0.2: v15.24,52.96 15.24,50.55 15.49,50.29 18.8,50.29 19.05,50.55 TP9.1
  Top 0.254: U6.5 24.25,11.43 v23.94,11.74 | v15.24,52.96 15.21,52.98 15.21,68.3 16,69.09 20.07,69.09 20.35,68.8 U8.13
  Bottom 0.254: v23.94,11.74 23.94,18.55 17.68,24.81 17.68,31.41 15.24,33.85 v15.24,52.96
PWR_P1
  Bottom 0.406: JP8.2 33.15,44.58 J1.3
RST  (via drill 0.25)
  Top 0.2: U3.6 24.08,62.29 23,63.37 v22.48,63.37 20.95,63.37 20.85,63.48 U8.4
  Top 0.254: 24.08,59.63 U3.6
  Bottom 0.2: MS1.1 42.75,76.63 24.05,76.63 22.86,75.44 22.86,74.46 22.48,74.08 v22.48,63.37
RTC_INT  (via drill 0.25)
  Top 0.254: TP7.1 MS1.20 | R9.1 14.61,31.46 | 14.61,31.46 U9.7 | v14.61,33.78 14.61,31.46
  Bottom 0.254: v14.61,33.78 14.61,53.98 MS1.20
SCK
  Top 0.2: MS1.11 20.57,76.45 24.22,76.45 25.4,75.28 25.4,74.27 25.91,73.76 28.08,73.76 28.82,73.03 33.15,73.03 36.45,69.72 U25.3
SCK_BUF
  Top 0.2: SD1.5 40.95,63.96 37.6,67.31 34.51,67.31 33.36,68.46 33.36,70.1 33.48,70.22 U25.5
SCL  (via drill 0.25)
  Top 0.2: U8.19 17.76,65.51 17.53,65.28 17.53,63.54 16.51,62.52 v16.51,57.15 | v8.26,57.02 8.89,56.39 MS1.18
  Top 0.254: U4.4 9.17,48.2 9.54,48.57 9.54,51.69 | MS1.18 9.54,53.96 9.54,51.69 | v15.88,31.88 U9.6 | U6.2 v26.92,11.43 | U7.2 v24.9,17.01 v24.89,17.02 | TP5.1 9.54,51.69
  Bottom 0.2: v16.51,57.15 16.49,57.13 8.36,57.13 v8.26,57.02
  Bottom 0.254: MS1.18 11.43,52.07 11.43,34.29 13.21,32.51 15.24,32.51 v15.88,31.88 16.51,31.24 16.51,24.82 22.84,18.5 22.84,11.96 23.88,10.92 24.89,10.92 | v26.92,11.43 26.42,10.92 24.89,10.92 | v24.89,17.02 24.89,10.92
SCL_EXT  (via drill 0.25)
  Top 0.254: U4.1 17.92,46.24 v22.61,50.93 | v29.21,52.07 34.54,52.07 35.56,51.05 35.56,45.26 34.77,44.48 34.11,44.48 32.51,42.88 v32.51,40.64 v32.51,29.21 32.51,18.29 J4.1
  Bottom 0.254: v22.61,50.93 28.07,50.93 v29.21,52.07 30.4,52.07 JP1.3 | v32.51,40.64 32.44,40.56 JP3.3 | v32.51,29.21 32.44,29.13 JP5.3
SD_CD  (via drill 0.25)
  Top 0.2: U8.11 24.4,68.01 24.82,67.59 30.7,67.59 v30.99,67.31 | v36.07,71.63 36.96,71.63 37.97,70.61 SD1.CD1
  Top 0.254: R12.1 39.34,72.26 SD1.CD1
  Bottom 0.2: v30.99,67.31 35.31,71.63 v36.07,71.63
SD_CS
  Top 0.2: MS1.10 23.49,73.03 27.82,73.03 28.53,72.32 32.85,72.32 34.67,70.5 34.67,69.85 34.54,69.72 U25.6
SD_CS_BUF
  Top 0.2: U25.2 45.21,69.22 47.16,67.26 SD1.2
SDA
  Top 0.254: U4.5 6.07,48.2 5.7,48.57 5.7,51.69 | 5.7,51.69 5.7,53.96 MS1.17 6.35,57.08 6.97,57.7 U5.4 6.46,58.59 5.93,58.06 4.46,58.06 3.62,58.9 JP10.2 | TP4.1 5.7,51.69
SDA_CTRL
  Top 0.254: R6.2 9.98,59.02 | MS1.19 11.43,56.01 10.16,57.28 R6.2 | U5.6 8.81,58.59 9.06,58.84 R6.2
SDA_EXT  (via drill 0.25)
  Top 0.254: v22.61,48.51 20.95,48.51 16.11,43.67 7.85,43.67 7.62,43.91 7.62,45.72 7.1,46.24 U4.8 | v33.3,41.91 33.25,41.86 v33.25,26.29 33.25,19.02 35.33,16.94 35.33,16.08 34.29,15.04 J4.2
  Bottom 0.254: 29.34,48.64 30.43,48.64 JP2.3 | 29.34,48.64 22.73,48.64 v22.61,48.51 | 35.46,41.91 35.46,46.15 34.85,46.76 32.79,46.76 32.38,46.35 29.72,46.35 29.34,46.73 29.34,48.64 | 35.46,41.91 35.46,38.86 34.47,37.87 33.68,37.87 33.07,37.26 JP4.3 | 35.46,41.91 v33.3,41.91 | JP6.3 32.79,25.83 v33.25,26.29
SDA_OB  (via drill 0.25)
  Top 0.2: 12.19,58.42 v13.97,58.42 | v17.14,58.42 17.14,62.53 18.35,63.74 U8.20
  Top 0.254: v17.14,30.61 U9.5 | U7.3 23.82,14.29 23.37,13.84 v23.37,13.46 23.37,11.56 24.14,10.78 U6.6 | TP6.1 12.19,52.45 v12.19,52.96 12.19,53.72 12.6,54.13 12.6,55.09 12.19,55.5 12.19,58.42 12.19,58.93 11.43,59.69 8.26,59.69 | JP10.1 2.69,59.69 6.16,59.69 6.31,59.84 7.64,59.84 7.79,59.69 8.26,59.69 | U5.1 8.27,59.7 8.26,59.69
  Bottom 0.2: v13.97,58.42 v17.14,58.42
  Bottom 0.254: v12.19,52.96 12.19,34.81 14,32.99 15.52,32.99 17.14,31.37 v17.14,30.61 17.14,24.77 23.37,18.54 v23.37,13.46
TIP  (via drill 0.25)
  Top 0.254: J6.P1 20.32,6.57 19.85,7.03 R8.2 19.85,23.66 v21.59,25.4 | v15.98,52.96 16.51,52.96 | 16.51,52.96 17.27,52.96 17.68,53.37 17.68,62.26 18.16,62.74 v18.8,62.74 | TP8.1 16.51,52.96
  Bottom 0.254: v21.59,25.4 21.59,29.08 15.98,34.7 v15.98,52.96 | v18.8,62.74 22.99,62.74 24.13,63.88 MS1.9
VBAT
  Top 0.305: BT1.POWER1 3.56,40.64 0.96,38.04 0.96,28 3.56,25.4 BT1.POWER0 6.9,25.95 C13.1 14.29,25.95 14.87,25.36 15.49,25.36 15.88,24.98 U9.3
VBAT-
  Top 0.406: Q1.3 3.47,8 2.85,7.38 J7.2
VBAT_FEATHER
  Top 0.406: Q1.1 5.57,8.07 6.35,7.29 J7.1
  Bottom 0.406: MS1.28 32.49,56.41 5.6,56.41 4.55,55.36 4.55,5.61 J7.1
VBUS_FEATHER
  Top 0.406: Q2.1 13.19,8.07 13.97,7.29 J8.1
  Bottom 0.406: MS1.26 27.96,55.85 5.83,55.85 5.11,55.13 5.11,7.59 6.35,6.35 11.43,6.35 J8.1
VSYS-
  Top 0.406: Q2.3 11.09,8 10.47,7.38 J8.2
WAKE  (via drill 0.25)
  Top 0.2: U3.5 24.89,58.67 25.02,58.8 25.02,61.8 v24.59,62.23 | v17.91,68.17 18.44,68.71 19.74,68.71 19.85,68.59 U8.14
  Bottom 0.2: v17.91,68.17 18.29,67.79 18.29,62.53 18.59,62.23 v24.59,62.23
WD_HOLD
  Top 0.254: MS1.24 24.08,54.66 U3.4

### Text on the board
tNames: J10 | J9
Document: (1 3/16 in) | (2.5 in)
tDocu: D1 | D2 | 3v3 | GND | D3 | D4 | 3v3 | GND | D5 | D6 | 3v3 | GND | SCL | SDA | 3v3 | BAT- | BAT+ | SYS- | SYS+ | GND | GND | TIP | GND | P1 | 3v3
bDocu: Project Hyena / v0.2 / Bobby Schulz / UMN/GEMS | Sense In | PORT1 | Core | Ext | SCL | GPIO | SDA | GPIO | Sense In | PORT2 | Sense In | PORT3 | I2C In | Bat In\ | 5v In | Tip In | Pot In